# EAGLE schematic smv_electrical_diagram (EAGLE 7.3.0)
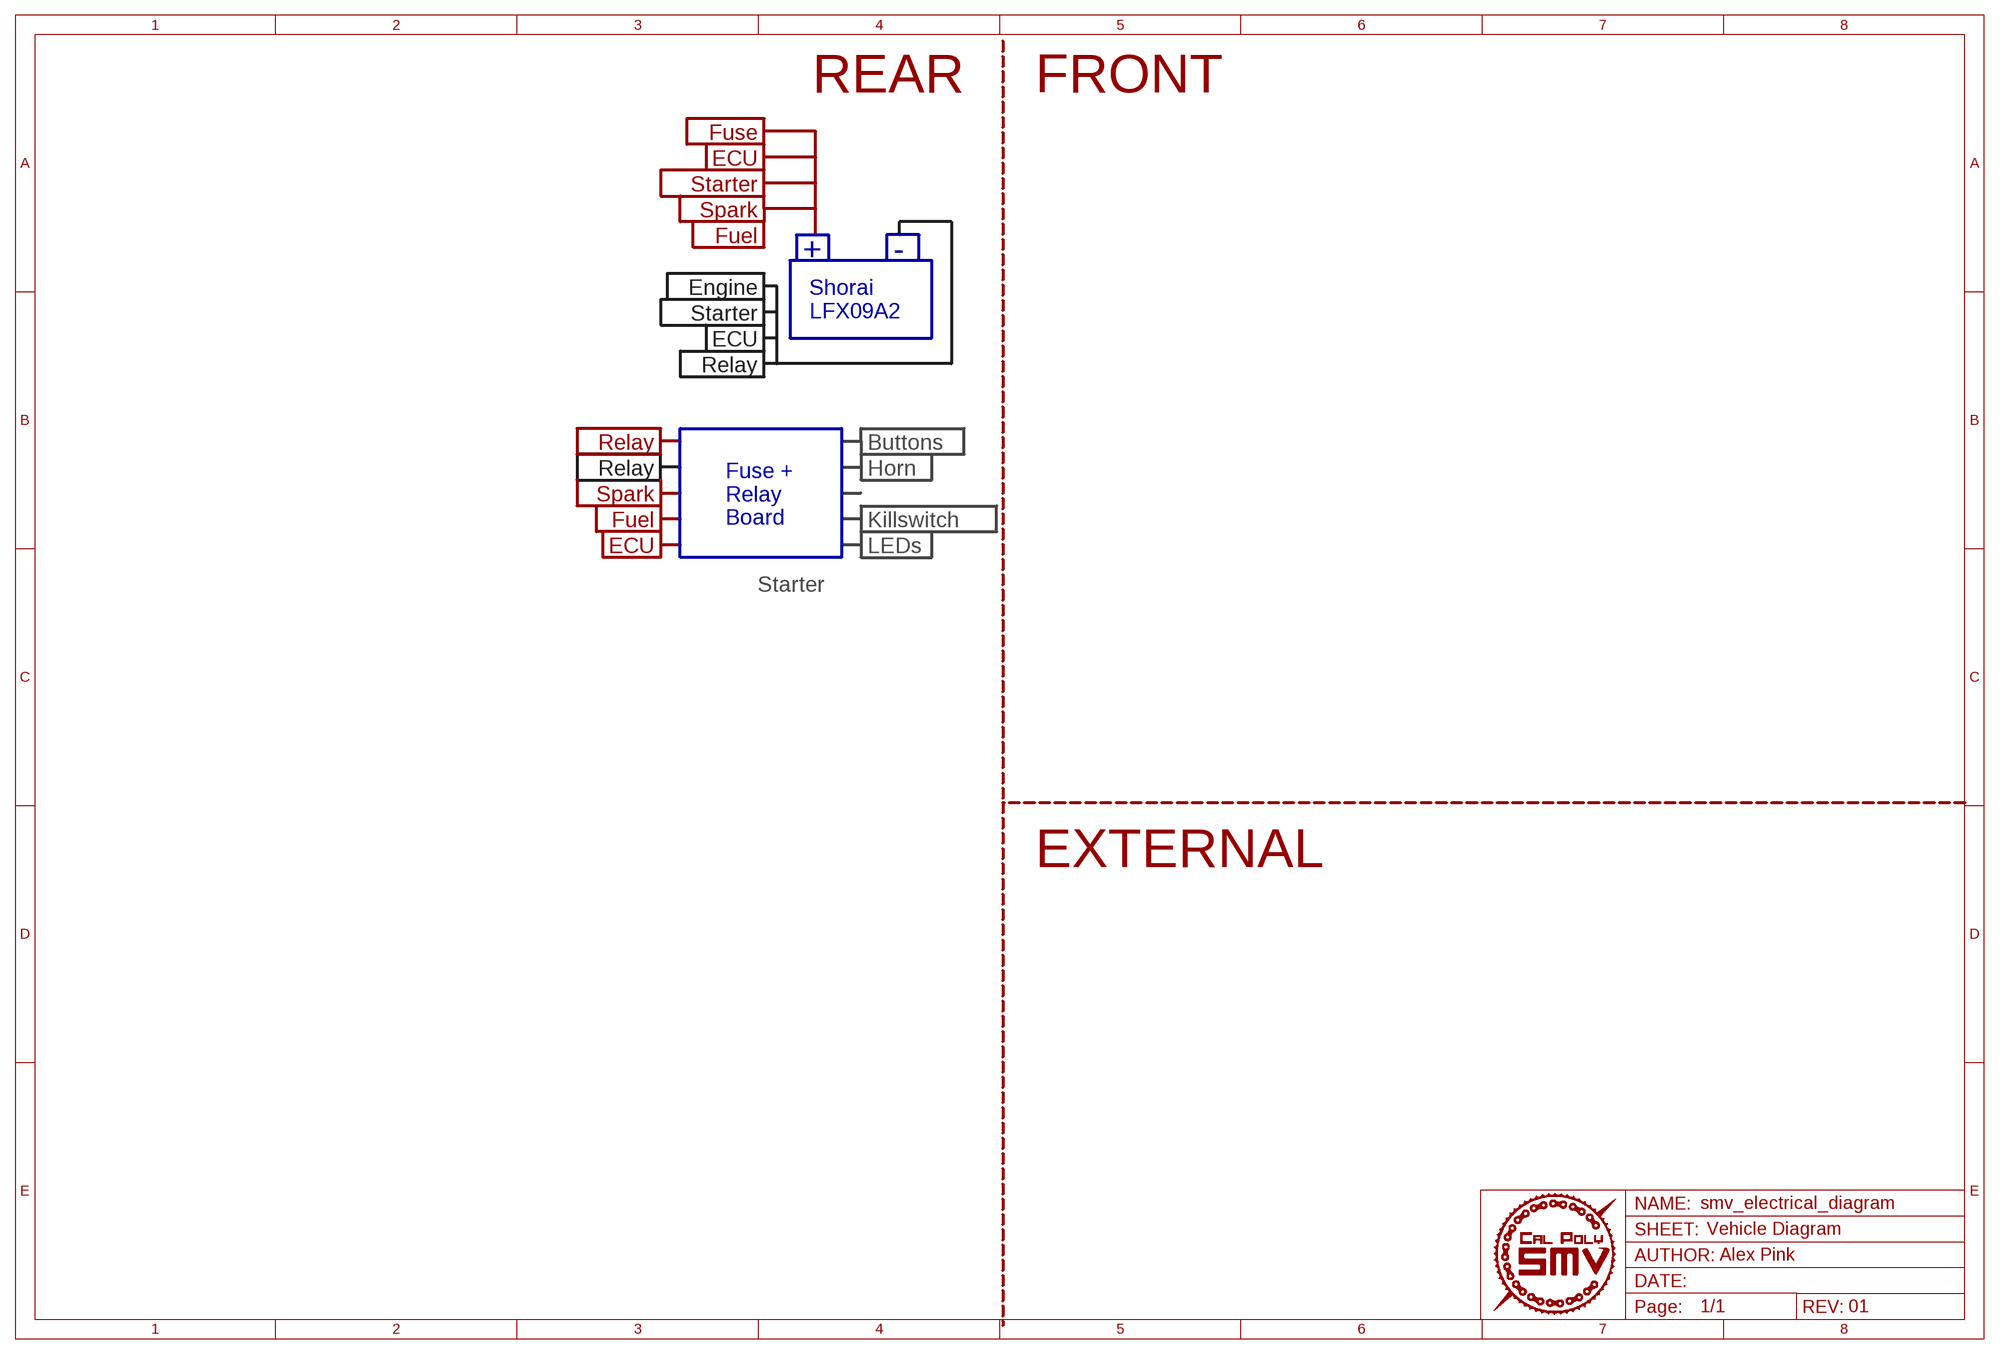
[diagram p0: schematic, sheet 1]

## Parts
U$1  CPSMV-FRAME  [CPSMV_FRAME]

## Buses
B$1
B$2

## Notes on the sheet
- REAR
- FRONT
- Fuse
- ECU
- Starter
- Spark
- Fuel
- + | -
- Engine
- Starter
- Shorai
  LFX09A2
- ECU
- Relay
- Relay | Buttons
- Relay | Horn
- Spark
- Fuel | Killswitch
- Fuse +
  Relay
  Board
- ECU | LEDs
- Starter
- EXTERNAL
- Vehicle Diagram
- Alex Pink
- 01

## Library data of the parts
U$1 = cpsmv:CPSMV-FRAME: Schematic / PCB doc frame for Supermileage.